# Altium schematic sheet mini_breadboard.SchDoc
size A4
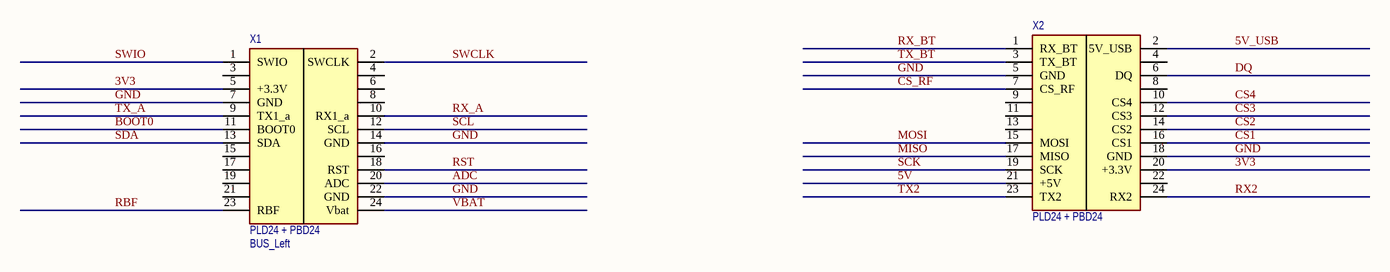
[diagram p0: mini_breadboard.SchDoc]

## Parts
X1  PLD24 + PBD24  Purpose: BUS_Left  [PICOSAT_CNN]
X2  PLD24 + PBD24  [PICOSAT_CNN]

## Nets
3V3: X1.5(+3.3V) X2.20(+3.3V)
5V: X2.21(+5V)
5V_USB: X2.2(5V_USB)
ADC: X1.20(ADC)
BOOT0: X1.11(BOOT0)
CS1: X2.16(CS1)
CS2: X2.14(CS2)
CS3: X2.12(CS3)
CS4: X2.10(CS4)
CS_RF: X2.7(CS_RF)
DQ: X2.6(DQ)
GND: X1.7(GND) X1.14(GND) X1.22(GND) X2.5(GND) X2.18(GND)
MISO: X2.17(MISO)
MOSI: X2.15(MOSI)
RBF: X1.23(RBF)
RST: X1.18(RST)
RX2: X2.24(RX2)
RX_A: X1.10(RX1_a)
RX_BT: X2.1(RX_BT)
SCK: X2.19(SCK)
SCL: X1.12(SCL)
SDA: X1.13(SDA)
SWCLK: X1.2(SWCLK)
SWIO: X1.1(SWIO)
TX2: X2.23(TX2)
TX_A: X1.9(TX1_a)
TX_BT: X2.3(TX_BT)
VBAT: X1.24(Vbat)

Not connected (* = marked no-connect by the designer): X1 3 4 6 8 15 16 17 19 21; X2 4 8 9 11 13 22

## Library data of the parts
X1 X2 = Header 2x12: 10x2 header; IsSMT: NoSMT